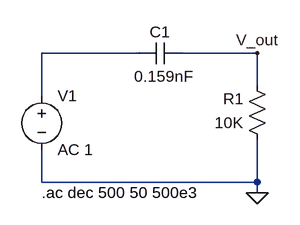
[diagram p0: schematic assig3_q4.asc]
assig3_q4.asc, the LTspice schematic file:
Version 4
SHEET 1 880 680
WIRE 192 64 48 64
WIRE 368 64 256 64
WIRE 368 112 368 64
WIRE 48 128 48 64
WIRE 48 256 48 208
WIRE 368 256 368 192
WIRE 368 256 48 256
WIRE 368 272 368 256
FLAG 368 272 0
FLAG 368 64 V_out
SYMBOL voltage 48 112 R0
SYMATTR InstName V1
SYMATTR Value AC 1
SYMBOL res 384 208 R180
WINDOW 0 36 76 Left 2
WINDOW 3 36 40 Left 2
SYMATTR InstName R1
SYMATTR Value 10K
SYMBOL cap 256 48 R90
WINDOW 0 0 32 VBottom 2
WINDOW 3 35 26 VTop 2
SYMATTR InstName C1
SYMATTR Value 0.159nF
TEXT 48 272 Left 2 !.ac dec 500 50 500e3

The netlist it stands for:
* assig3_q4.asc
V1 N001 0 AC 1
R1 0 V_out 10K
C1 V_out N001 0.159nF
.ac dec 500 50 500e3
.backanno
.end